# Altium schematic sheet Peripherals.SchDoc: Peripherals
size A4; DocumentNumber: MB1246; Revision: B.1; SheetNumber: 13; SheetTotal: 17; Project: STM32H7xxI-EVAL
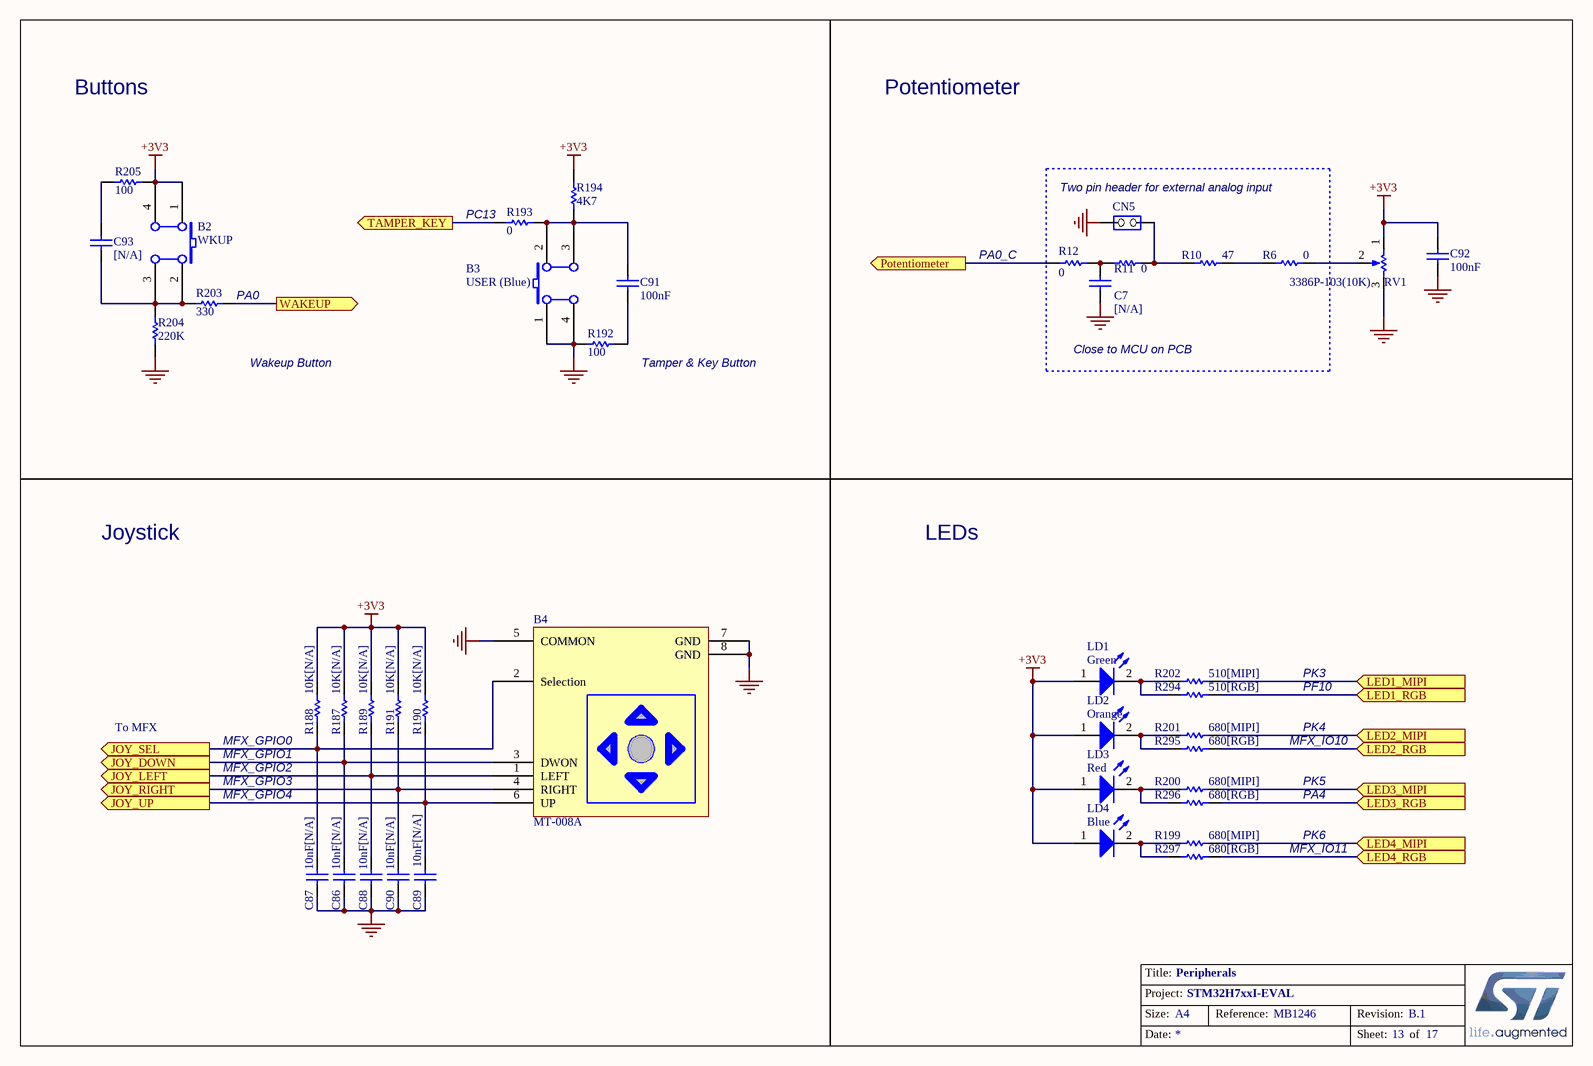
[diagram p0: Peripherals.SchDoc]

## Parts
B2  WKUP  [PB10]
B3  USER (Blue)  [PB10]
B4  MT-008A  [MT-008A]
C7  [N/A]  [0603C]
C86  10nF[N/A]  [0603C]
C87  10nF[N/A]  [0603C]
C88  10nF[N/A]  [0603C]
C89  10nF[N/A]  [0603C]
C90  10nF[N/A]  [0603C]
C91  100nF  [0603C]
C92  100nF  [0603C]
C93  [N/A]  [0603C]
CN5  (no value)  [SIP2]
LD1  Green  [0603D]
LD2  Orange  [0603D]
LD3  Red  [0603D]
LD4  Blue  [0603D]
R6  0  [0603R]
R10  47  [0603R]
R11  0  [0603R]
R12  0  [0603R]
R187  10K[N/A]  [0603R]
R188  10K[N/A]  [0603R]
R189  10K[N/A]  [0603R]
R190  10K[N/A]  [0603R]
R191  10K[N/A]  [0603R]
R192  100  [0603R]
R193  0  [0603R]
R194  4K7  [0603R]
R199  680[MIPI]  [0603R]
R200  680[MIPI]  [0603R]
R201  680[MIPI]  [0603R]
R202  510[MIPI]  [0603R]
R203  330  [0603R]
R204  220K  [0603R]
R205  100  [0603R]
R294  510[RGB]  [0603R]
R295  680[RGB]  [0603R]
R296  680[RGB]  [0603R]
R297  680[RGB]  [0603R]
RV1  3386P-103(10K)  [3386P]

## Ports
JOY_DOWN (out), JOY_LEFT (out), JOY_RIGHT (out), JOY_SEL (out), JOY_UP (out), LED1_MIPI (in), LED1_RGB (in), LED2_MIPI (in), LED2_RGB (in), LED3_MIPI (in), LED3_RGB (in), LED4_MIPI (in), LED4_RGB (in), Potentiometer (out), TAMPER_KEY (out), WAKEUP (out)

## Nets
+3V3: B2.1(A0) B2.4(A1) C92.1 LD1.1(A) LD2.1(A) LD3.1(A) LD4.1(A) R187.1 R188.1 R189.1 R190.1 R191.1 R194.2 R205.1 RV1.1(BOT)
GND: B3.1(A0) B3.4(A1) B4.5(COMMON) B4.7(GND) B4.8(GND) C7.1 C86.1 C87.1 C88.1 C89.1 C90.1 C92.2 CN5.2(NO) R192.1 R204.2 RV1.3(TOP)
JOY_DOWN: B4.3(DWON) C86.2 R187.2 ; port JOY_DOWN
JOY_LEFT: B4.1(LEFT) C88.2 R189.2 ; port JOY_LEFT
JOY_RIGHT: B4.4(RIGHT) C90.2 R191.2 ; port JOY_RIGHT
JOY_SEL: B4.2(Selection) C87.2 R188.2 ; port JOY_SEL
JOY_UP: B4.6(UP) C89.2 R190.2 ; port JOY_UP
LED1_MIPI: R202.1 ; port LED1_MIPI
LED1_RGB: R294.1 ; port LED1_RGB
LED2_MIPI: R201.1 ; port LED2_MIPI
LED2_RGB: R295.1 ; port LED2_RGB
LED3_MIPI: R200.1 ; port LED3_MIPI
LED3_RGB: R296.1 ; port LED3_RGB
LED4_MIPI: R199.1 ; port LED4_MIPI
LED4_RGB: R297.1 ; port LED4_RGB
Potentiometer: R12.2 ; port Potentiometer
TAMPER_KEY: R193.2 ; port TAMPER_KEY
WAKEUP: R203.2 ; port WAKEUP
NetB2_2: B2.2(B0) B2.3(B1) C93.2 R203.1 R204.1
NetB3_2: B3.2(B0) B3.3(B1) C91.2 R193.1 R194.1
NetC7_2: C7.2 R11.1 R12.1
NetC91_1: C91.1 R192.2
NetC93_1: C93.1 R205.2
NetCN5_1: CN5.1(COMMON) R10.1 R11.2
NetLD1_2: LD1.2(K) R202.2 R294.2
NetLD2_2: LD2.2(K) R201.2 R295.2
NetLD3_2: LD3.2(K) R200.2 R296.2
NetLD4_2: LD4.2(K) R199.2 R297.2
NetR6_1: R6.1 R10.2
NetR6_2: R6.2 RV1.2(TAP)

## Notes on the sheet
- Buttons
- Potentiometer
- (near CN5) Two pin header for external analog input
- (near R193) PC13
- (near R12) PA0_C
- (near R203) PA0
- Wakeup Button
- (near R192) Tamper & Key Button
- Close to MCU on PCB
- Joystick
- LEDs
- To MFX
- PK3
- PK4
- PF10
- (near R188) MFX_GPIO0
- MFX_GPIO1
- MFX_GPIO2
- MFX_GPIO3
- MFX_GPIO4
- MFX_IO10
- PK5
- PA4
- MFX_IO11
- PK6
- Title:
- Project:
- Size:
- Date:
- A4
- Reference:
- Sheet:
- Revision:
- of

## Library data of the parts
B2 B3 = SW PUSHBUTTON: SE PUSHBUTTON
C7 = cap: Capacitor; Value: 100pF; Published: 8-Jun-2000; Revision: July-2002: Re-released for DXP Platform.; Publisher: Altium Limited
C86-C93 = CAP: Capacitor; Value: 100pF; Published: 8-Jun-2000; Revision: July-2002: Re-released for DXP Platform.; Publisher: Altium Limited
CN5 = JP2
LD1-LD4 = LED2: Typical RED, GREEN, YELLOW, AMBER GaAs LED; Published: 8-Jun-2000; Revision: July-2002: Re-released for DXP Platform.; Publisher: Altium Limited
R6 R10-R12 R192 R193 R199-R203 R205 R294-R297 = Res1: Resistor; Value: 1K; Published: 8-Jun-2000; Revision: July-2002: Re-released for DXP Platform.; Publisher: Altium Limited
R187-R191 R194 R204 = res1: Resistor; Value: 1K; Published: 8-Jun-2000; Revision: July-2002: Re-released for DXP Platform.; Publisher: Altium Limited
RV1 = RV